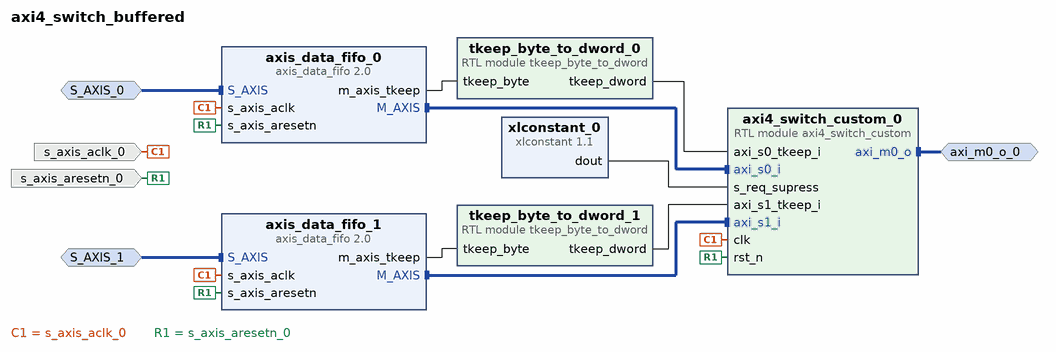
[diagram p0: block diagram of the top level]
# Vivado block design axi4_switch_buffered, xcvc1902-vsva2197-2MP-e-S, Vivado 2021.2
create_bd_design axi4_switch_buffered

create_bd_intf_port -mode Master -vlnv xilinx.com:interface:axis_rtl:1.0 axi_m0_o_0
create_bd_intf_port -mode Slave -vlnv xilinx.com:interface:axis_rtl:1.0 S_AXIS_0
set_property -dict [list \
  CONFIG.HAS_TKEEP 1 \
  CONFIG.HAS_TLAST 1 \
  CONFIG.HAS_TREADY 1 \
  CONFIG.HAS_TSTRB 0 \
  CONFIG.LAYERED_METADATA undef \
  CONFIG.TDATA_NUM_BYTES 64 \
  CONFIG.TDEST_WIDTH 0 \
  CONFIG.TID_WIDTH 0 \
  CONFIG.TUSER_WIDTH 81 \
] [get_bd_intf_ports S_AXIS_0]
create_bd_intf_port -mode Slave -vlnv xilinx.com:interface:axis_rtl:1.0 S_AXIS_1
set_property -dict [list \
  CONFIG.HAS_TKEEP 1 \
  CONFIG.HAS_TLAST 1 \
  CONFIG.HAS_TREADY 1 \
  CONFIG.HAS_TSTRB 0 \
  CONFIG.LAYERED_METADATA undef \
  CONFIG.TDATA_NUM_BYTES 64 \
  CONFIG.TDEST_WIDTH 0 \
  CONFIG.TID_WIDTH 0 \
  CONFIG.TUSER_WIDTH 81 \
] [get_bd_intf_ports S_AXIS_1]
create_bd_port -dir I -type clk s_axis_aclk_0
set_property -dict {CONFIG.ASSOCIATED_BUSIF axi_m0_o_0:S_AXIS_0:S_AXIS_1} [get_bd_ports s_axis_aclk_0]
create_bd_port -dir I -type rst s_axis_aresetn_0

create_bd_cell -type module -reference axi4_switch_custom axi4_switch_custom_0
create_bd_cell -type ip -vlnv xilinx.com:ip:axis_data_fifo:2.0 axis_data_fifo_0
set_property -dict [list \
  CONFIG.HAS_TKEEP 1 \
  CONFIG.HAS_TLAST 1 \
  CONFIG.TDATA_NUM_BYTES 64 \
  CONFIG.TUSER_WIDTH 81 \
] [get_bd_cells axis_data_fifo_0]
create_bd_cell -type ip -vlnv xilinx.com:ip:axis_data_fifo:2.0 axis_data_fifo_1
set_property -dict [list \
  CONFIG.HAS_TKEEP 1 \
  CONFIG.HAS_TLAST 1 \
  CONFIG.TDATA_NUM_BYTES 64 \
  CONFIG.TUSER_WIDTH 81 \
] [get_bd_cells axis_data_fifo_1]
create_bd_cell -type ip -vlnv xilinx.com:ip:xlconstant:1.1 xlconstant_0
set_property -dict {CONFIG.CONST_VAL 0 CONFIG.CONST_WIDTH 2} [get_bd_cells xlconstant_0]
create_bd_cell -type module -reference tkeep_byte_to_dword tkeep_byte_to_dword_0
create_bd_cell -type module -reference tkeep_byte_to_dword tkeep_byte_to_dword_1

# ---- connections ----

connect_bd_intf_net -intf_net S_AXIS_0_1 [get_bd_intf_ports S_AXIS_0] [get_bd_intf_pins axis_data_fifo_0/S_AXIS]
connect_bd_intf_net -intf_net S_AXIS_1_1 [get_bd_intf_ports S_AXIS_1] [get_bd_intf_pins axis_data_fifo_1/S_AXIS]
connect_bd_intf_net [get_bd_intf_ports axi_m0_o_0] [get_bd_intf_pins axi4_switch_custom_0/axi_m0_o]
connect_bd_intf_net [get_bd_intf_pins axis_data_fifo_0/M_AXIS] [get_bd_intf_pins axi4_switch_custom_0/axi_s0_i]
connect_bd_intf_net [get_bd_intf_pins axis_data_fifo_1/M_AXIS] [get_bd_intf_pins axi4_switch_custom_0/axi_s1_i]
connect_bd_net [get_bd_pins axis_data_fifo_0/m_axis_tkeep] [get_bd_pins tkeep_byte_to_dword_0/tkeep_byte]
connect_bd_net [get_bd_pins axis_data_fifo_1/m_axis_tkeep] [get_bd_pins tkeep_byte_to_dword_1/tkeep_byte]
connect_bd_net -net s_axis_aclk_0_1 [get_bd_ports s_axis_aclk_0] \
  [get_bd_pins axis_data_fifo_0/s_axis_aclk] [get_bd_pins axi4_switch_custom_0/clk] \
  [get_bd_pins axis_data_fifo_1/s_axis_aclk]
connect_bd_net -net s_axis_aresetn_0_1 [get_bd_ports s_axis_aresetn_0] \
  [get_bd_pins axis_data_fifo_0/s_axis_aresetn] [get_bd_pins axi4_switch_custom_0/rst_n] \
  [get_bd_pins axis_data_fifo_1/s_axis_aresetn]
connect_bd_net [get_bd_pins tkeep_byte_to_dword_0/tkeep_dword] [get_bd_pins axi4_switch_custom_0/axi_s0_tkeep_i]
connect_bd_net [get_bd_pins tkeep_byte_to_dword_1/tkeep_dword] [get_bd_pins axi4_switch_custom_0/axi_s1_tkeep_i]
connect_bd_net [get_bd_pins xlconstant_0/dout] [get_bd_pins axi4_switch_custom_0/s_req_supress]

validate_bd_design
save_bd_design
